# Altium schematic sheet EndEffector- CAN.SchDoc
size A
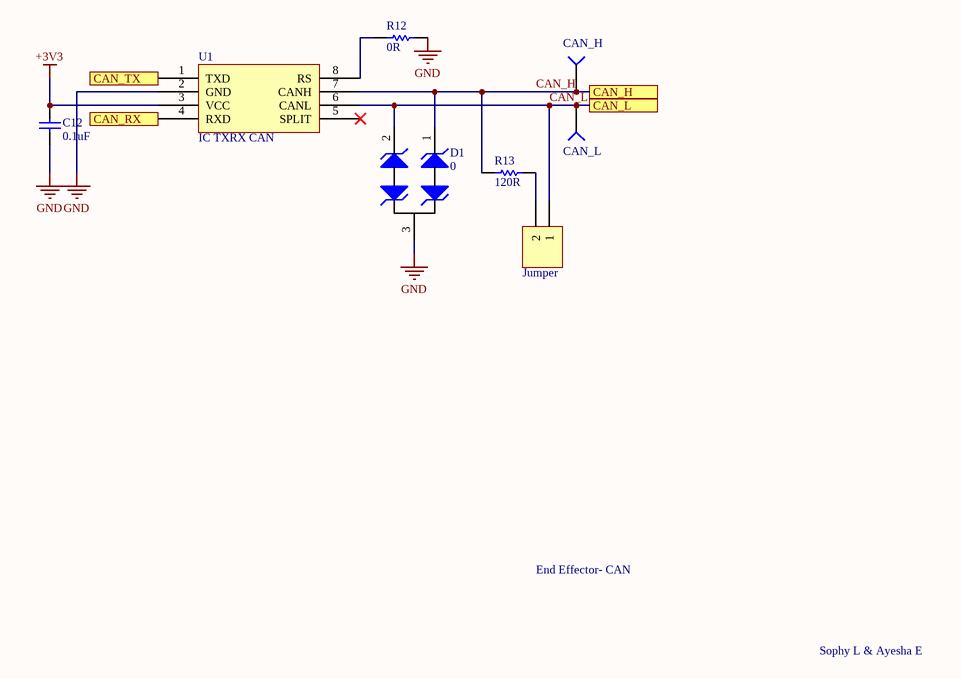
[diagram p0: EndEffector- CAN.SchDoc]

## Parts
(Parts that share a designator on the sheet are numbered #1, #2 ... from top to bottom, then left to right.)
?  Jumper  [HDR1X2]
C12  value 0.1uF  [CAPC0603(1608)55_N]  (hidden comment: CAP_0.1uF_16V_0603)
D1  0
R12  value 0R  [RESC0201(0603)_N]  (hidden comment: RES_0R_0603)
R13  value 120R  [RESC0201(0603)_N]  (hidden comment: RES_120R_0603)
TP?#1  CAN_H  [TESTPOINT]
TP?#2  CAN_L  [TESTPOINT]
U1  IC TXRX CAN

## Ports
CAN_H, CAN_L, CAN_RX, CAN_TX

## Nets
+3V3: C12.2 U1.3(VCC)
GND: C12.1 D1.3 R12.2 U1.2(GND)
CAN_H: D1.1 R13.1 TP?#1.1(=value) U1.7(CANH) ; port CAN_H
CAN_L: ?.1 D1.2 TP?#2.1(=value) U1.6(CANL) ; port CAN_L
CAN_RX: U1.4(RXD) ; port CAN_RX
CAN_TX: U1.1(TXD) ; port CAN_TX
Net?_2: ?.2 R13.2
NetR12_1: R12.1 U1.8(RS)

Not connected (* = marked no-connect by the designer): U1 5(SPLIT)*

## Notes on the sheet
- End Effector- CAN
- Sophy L & Ayesha E

## Library data of the parts
? = Header 2: Header, 2-Pin; LatestRevisionDate: 17-Jul-2002; LatestRevisionNote: Re-released for DXP Platform.; Publisher: Altium Limited
C12 = CAP_0.1uF_16V_0603: CAP CER 0.1UF 16V X7R 0603; Part Number: CC0603KRX7R7BB104; Manufacturer: Yageo; Dimensions: 0.063" L x 0.031" W (1.60mm x 0.80mm); Package: 0603 (1608 Metric); Temperature Coefficient: X7R; Voltage Rating: 16V
D1 = TVS_DIODE_CAN: TVS DIODE 24V 50V SOT323-3; Part Number: PESD1CAN-UX; Manufacturer: Nexperia USA Inc.; Package: SC-70, SOT-323; ComponentLink1Description: Datasheet; ComponentLink1URL: https://assets.nexperia.com/documents/data-sheet/PESD1CAN-U.pdf
R12 = RES_0R_0603: RES SMD 0 OHM JUMPER 1/10W 0603; Manufacturer: Yageo; Part Number (MPN): RC0603JR-070RL; Package: 0603 (1608 Metric); Dimensions: 0.063" L x 0.031" W (1.60mm x 0.80mm)
R13 = RES_120R_0603: RES SMD 120 OHM 5% 1/10W 0603; Manufacturer: Yageo; Part Number (MPN): RC0603JR-07120RL; Package: 0603 (1608 Metric); Dimensions: 0.063" L x 0.031" W (1.60mm x 0.80mm); Tolerance: 5%
TP?#1 TP?#2 = TESTPOINT_SMD
U1 = LTC2875: IC TXRX CAN 4MBPS 8SO; Manufacturer: Linear Technologies; Part Number: LTC2875IS8#PBF; Package: 8-SOIC (0.154", 3.90mm Width); ComponentLink1Description: Datasheet; ComponentLink1URL: https://www.analog.com/media/en/technical-documentation/data-sheets/2875f.pdf